# EAGLE schematic Accumulator TS Schematic (EAGLE 9.6.2)
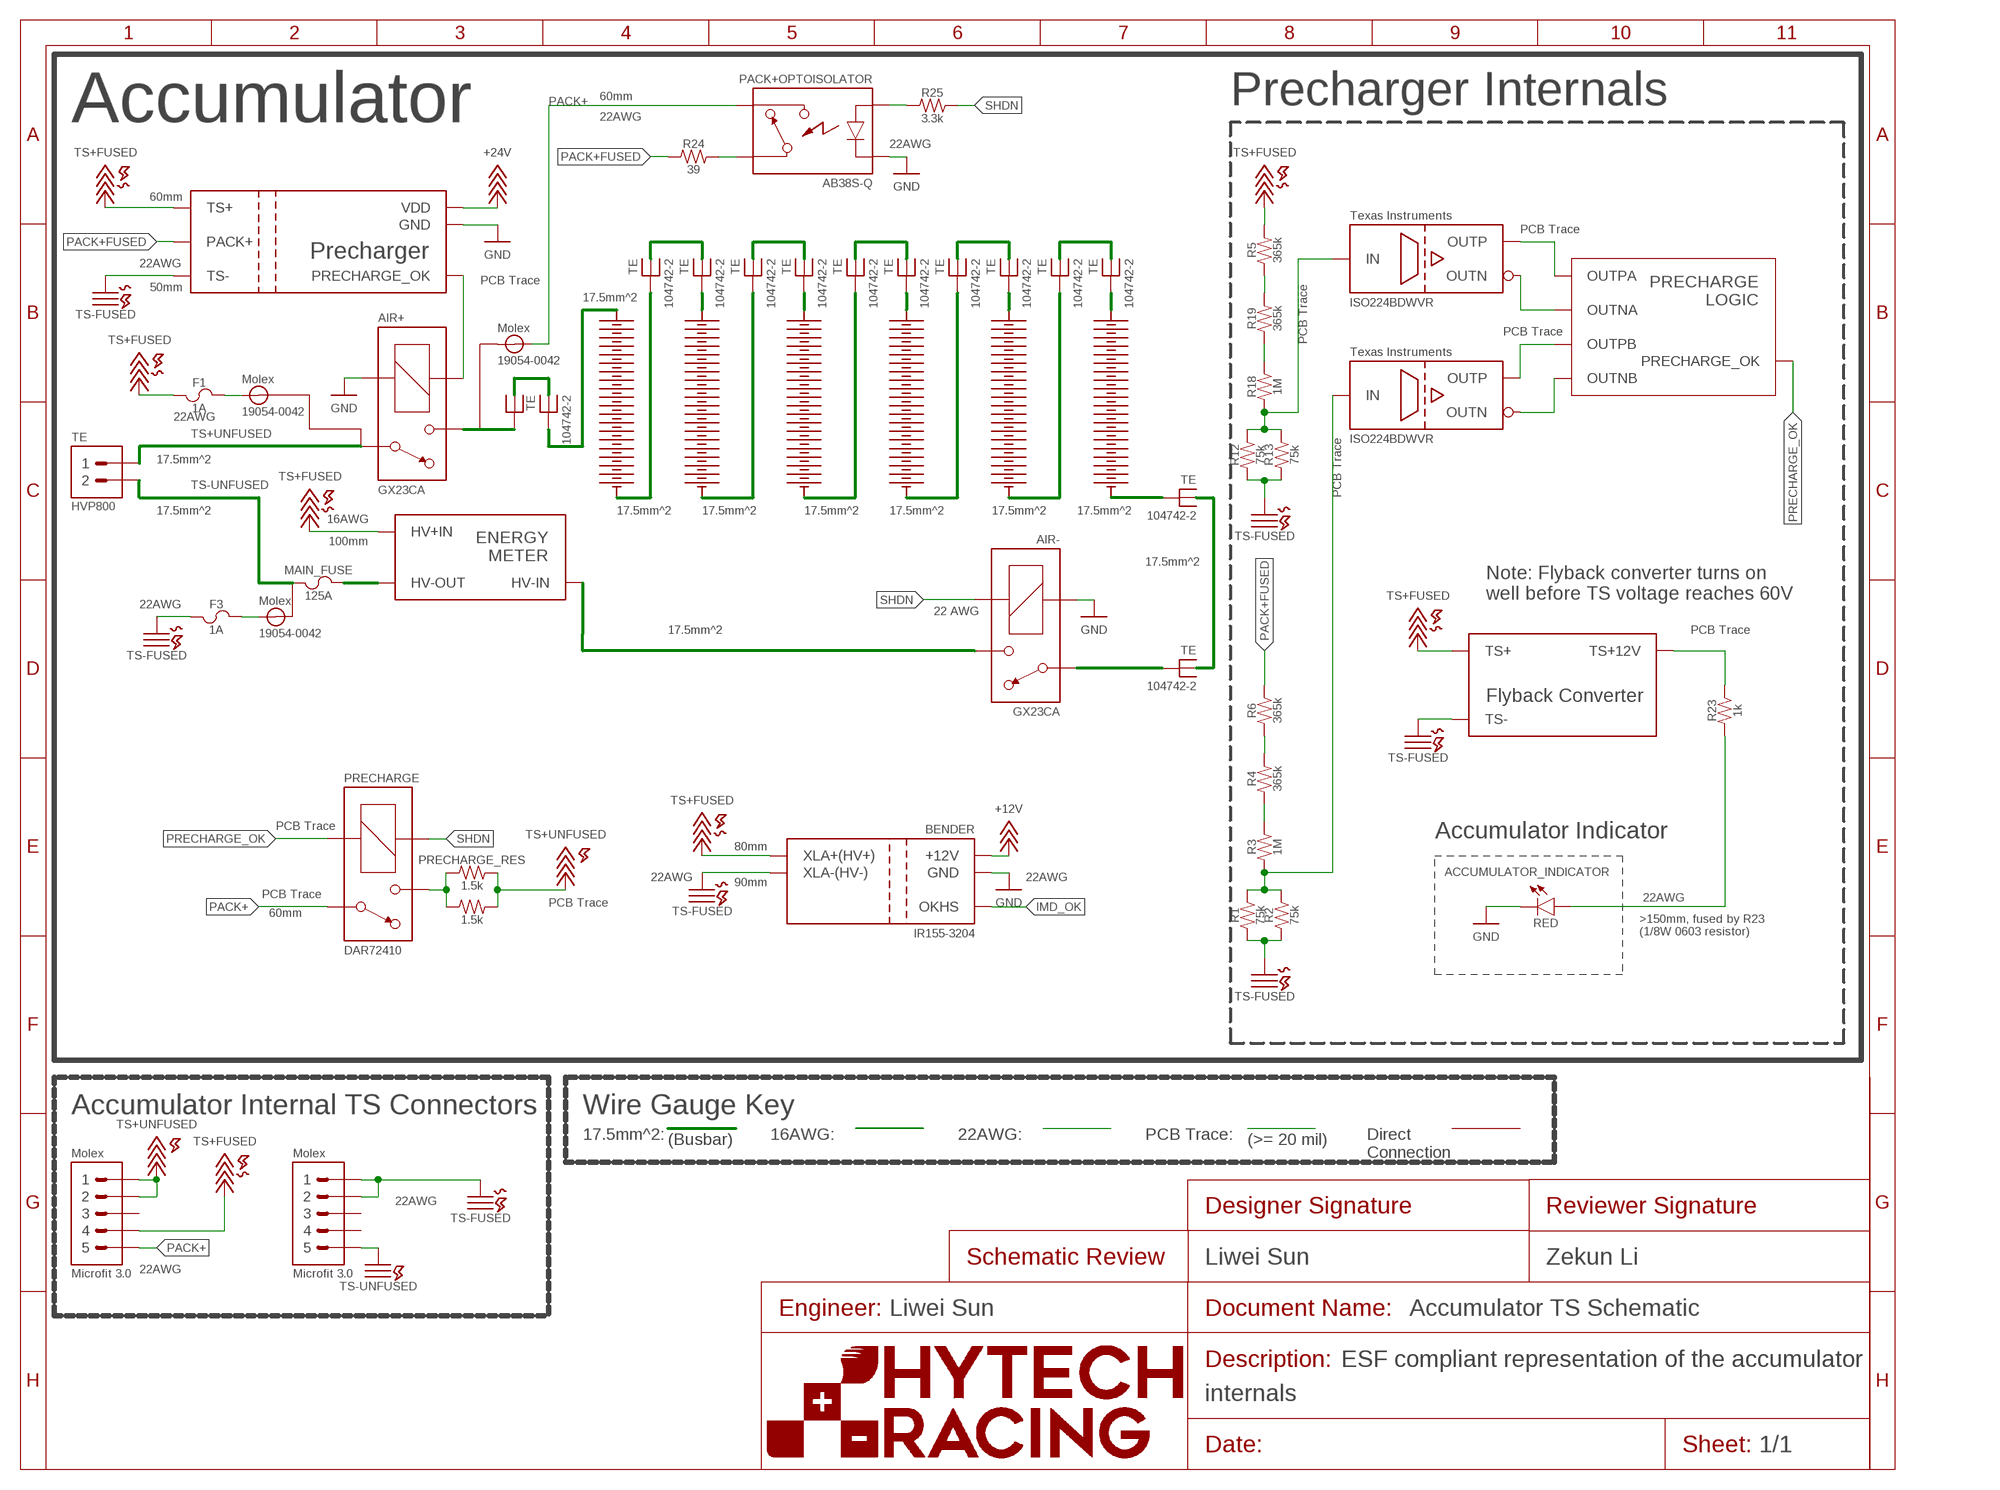
[diagram p0: schematic, sheet 1]
U$10 (FRAME_SCHEMATIC_ONLY): DESCRIPTION_1: ESF compliant representation of the accumulator; DESCRIPTION_2: internals; DESIGNER_SCHEMATIC: Liwei Sun; ENGINEER: Liwei Sun; REVIEWER_SCHEMATIC: Zekun Li

## Parts
A1  PRECHARGE_LOGIC  (no package)
ACCUMULATOR_INDICATOR  DIODE_LED  (no package)
AIR+  RELAY_SPST_NO_  (no package)
AIR-  RELAY_SPST_NO_  (no package)
F1  1A  FUSE  (no package)
F3  1A  FUSE  (no package)
J1  CONNECTOR-2_HVP800  (no package)
J6  CONNECTOR-5_MICROFIT  (no package)
J8  CONNECTOR-5_MICROFIT  (no package)
MAIN_FUSE  125A  FUSE  (no package)
PACK+OPTOISOLATOR  RELAY_SOLIDSTATE_NO_  (no package)
PRECHARGE  RELAY_SPST_NO_  (no package)
PRECHARGE_RES  1.5k  RESISTOR  (no package)
PRECHARGE_RES2  1.5k  RESISTOR  (no package)
R1  75k  RESISTOR  (no package)
R2  75k  RESISTOR  (no package)
R3  1M  RESISTOR  (no package)
R4  365k  RESISTOR  (no package)
R5  365k  RESISTOR  (no package)
R6  365k  RESISTOR  (no package)
R12  75k  RESISTOR  (no package)
R13  75k  RESISTOR  (no package)
R18  1M  RESISTOR  (no package)
R19  365k  RESISTOR  (no package)
R23  1k  RESISTOR  (no package)
R24  39  RESISTOR  (no package)
R25  3.3k  RESISTOR  (no package)
U1  ISO_224BDWVR  (no package)
U2  ISO_224BDWVR  (no package)
U$1  BENDER_IR155-3204  (no package)
U$2  SEGMENT  (no package)
U$3  SEGMENT  (no package)
U$4  SEGMENT  (no package)
U$5  SEGMENT  (no package)
U$6  SEGMENT  (no package)
U$7  MAINTENANCE_PLUG_104742-2  (no package)
U$8  MAINTENANCE_PLUG_104742-2  (no package)
U$9  MAINTENANCE_PLUG_104742-2  (no package)
U$11  PRECHARGER  (no package)
U$12  MAINTENANCE_PLUG_104742-2  (no package)
U$13  MAINTENANCE_PLUG_104742-2  (no package)
U$14  ENERGY_METER  (no package)
U$15  MAINTENANCE_PLUG_104742-2  (no package)
U$16  MAINTENANCE_PLUG_104742-2  (no package)
U$21  SEGMENT  (no package)
U$22  MAINTENANCE_PLUG_104742-2  (no package)
U$27  MAINTENANCE_PLUG_104742-2  (no package)
U$29  FLYBACK_CONVERTER  (no package)
U$31  MAINTENANCE_PLUG_104742-2  (no package)
U$32  MAINTENANCE_PLUG_104742-2  (no package)
U$33  MAINTENANCE_PLUG_104742-2  (no package)
U$34  MAINTENANCE_PLUG_104742-2  (no package)
U$35  MAINTENANCE_PLUG_104742-2  (no package)
U$36  RING_TERMINAL_19054-0042  (no package)
U$37  RING_TERMINAL_19054-0042  (no package)
U$38  RING_TERMINAL_19054-0042  (no package)

## Nets
+5V: U$11.VDD ; supply symbol labelled +24V
+12V: U$1.+12V
GND: ACCUMULATOR_INDICATOR.C AIR+.COIL+ AIR-.COIL+ PACK+OPTOISOLATOR.CONTROL- U$1.GND U$11.GND
IMD_OK: U$1.OKHS
N$1: U$3.- U$7.1
N$2: U$4.- U$15.1
N$3: U$5.- U$16.1
N$4: U$4.+ U$8.1
N$5: U$5.+ U$9.1
N$6: U$6.+ U$31.1
N$7: U$7.P$1 U$8.P$1
N$8: PRECHARGE.CONTACT2 PRECHARGE_RES2.1 PRECHARGE_RES.1
N$10: PACK+OPTOISOLATOR.CONTACT1 R24.2
N$11: PACK+OPTOISOLATOR.CONTROL+ R25.1
N$12: MAIN_FUSE.2 U$14.HV-OUT
N$13: R3.2 R4.1
N$14: R18.2 R19.1
N$15: U$6.- U$12.1
N$16: U$21.- U$34.1
N$17: AIR+.CONTACT2 U$32.1
N$18: R5.1 R19.2
N$19: AIR-.CONTACT1 U$35.1
N$20: R4.2 R6.1
N$21: U$9.P$1 U$15.P$1
N$22: U$2.+ U$13.1
N$23: U$16.P$1 U$31.P$1
N$24: U$12.P$1 U$13.P$1
N$25: U$2.- U$22.1
N$26: U$21.+ U$27.1
N$27: U$22.P$1 U$27.P$1
N$28: A1.OUTPB U1.OUTP
N$29: R1.2 R2.2 R3.1 U1.IN
N$30: U$32.P$1 U$33.P$1
N$31: A1.OUTNB U1.OUTN
N$32: A1.OUTPA U2.OUTP
N$33: U$34.P$1 U$35.P$1
N$34: A1.OUTNA U2.OUTN
N$35: R23.2 U$29.TS+12V
N$36: ACCUMULATOR_INDICATOR.A R23.1
N$45: AIR-.CONTACT2 U$14.HV-IN
N$48: R12.2 R13.2 R18.1 U2.IN
N$50: F3.2 U$36.P$1
N$51: F1.2 U$37.P$1
PACK+: J6.5 PACK+OPTOISOLATOR.CONTACT2 PRECHARGE.CONTACT1 U$3.+ U$33.1 U$38.P$2
PACK+FUSED: R6.2 R24.1 U$11.PACK+
PRECHARGE_OK: A1.PRECHARGE_OK AIR+.COIL- PRECHARGE.COIL+ U$11.PRECHARGE_OK
SHDN: AIR-.COIL- PRECHARGE.COIL- R25.2
TS+: F1.1 J6.4 R5.2 U$1.XLA+(HV+) U$11.TS+ ; supply symbol labelled TS+FUSED
TS+FUSED: U$14.HV+IN U$29.TS+
TS+UNFUSED: AIR+.CONTACT1 J1.1 J6.1 J6.2 PRECHARGE_RES2.2 PRECHARGE_RES.2
TS-FUSED: U$29.TS-
TS-UNFUSED: F3.1 J1.2 J8.1 J8.2 J8.5 MAIN_FUSE.1 R1.1 R2.1 R12.1 R13.1 U$1.XLA-(HV-) U$11.TS- ; supply symbol labelled TS-FUSED
Unconnected: J6.3 J8.3 J8.4 U$36.P$2 U$37.P$2 U$38.P$1

## Notes on the sheet
- Accumulator
- 60mm
- Precharger Internals
- 22AWG
- 22AWG
- 60mm
- PCB Trace
- 22AWG
- PCB Trace
- 50mm | 17.5mm^2
- PCB Trace
- PCB Trace
- 22AWG
- 17.5mm^2
- PCB Trace
- 17.5mm^2 | 16AWG | 17.5mm^2 | 17.5mm^2 | 17.5mm^2 | 17.5mm^2 | 17.5mm^2 | 17.5mm^2
- 100mm
- 17.5mm^2
- 22AWG
- Note: Flyback converter turns on 
  well before TS voltage reaches 60V
- 22 AWG
- 17.5mm^2 | PCB Trace
- PCB Trace
- Accumulator Indicator
- 80mm
- 22AWG | 22AWG
- 90mm
- PCB Trace
- 22AWG
- PCB Trace
- 60mm
- >150mm, fused by R23 
  (1/8W 0603 resistor)
- Accumulator Internal TS Connectors | Wire Gauge Key
- 17.5mm^2: | 16AWG: | 22AWG: | PCB Trace:
- Direct
  Connection
- (Busbar) | (>= 20 mil)
- 22AWG
- 22AWG

## Library data of the parts
A1 = HyTechSymbols:PRECHARGE_LOGIC: Block representation of the precharge logic.
ACCUMULATOR_INDICATOR = HyTechSymbols:DIODE_LED; COLOR: RED
AIR+ AIR- = HyTechSymbols:RELAY_SPST_NO_?*: Single pole single throw normally open relay 3350-1275-126 <https://drive.google.com/file/d/1L0NeZqCX2TFaVQbwFxpbbu9uMJSPuulv/view> GX23BA <https://drive.google.com/file/d/1Ccq0vir690jgHxUhztItQKfgtS51YNj_/view>; MPN: GX23CA
F1 F3 MAIN_FUSE = HyTechSymbolsTemp:FUSE
J1 = HyTechSymbols:CONNECTOR-2_*: Two pin connector EVH2-N2TK-TDA <https://drive.google.com/file/d/1gQfuywpa-Tm7bohh-tcSjjxbyqcnD_h9/view> HPK <https://drive.google.com/file/d/1jTQMZ26zoHotHQHZYMoMT2jUzRt664sO/view> HVP800 <https://drive.google.com/file/d/1j-HswfqYHj8usJ9E3bf8NWBzB-X0BKJ4/view>; MANUFACTURER: TE; MPN: HVP800
J6 J8 = HyTechSymbolsTemp:CONNECTOR-5_*: Five pin connector Micro-Fit 3.0 <https://drive.google.com/file/d/1Be8WGxzm3IeOWSN4qfSP8J4bwHUWCwaO/view>; MANUFACTURER: Molex; MPN: Microfit 3.0
PACK+OPTOISOLATOR = HyTechSymbols:RELAY_SOLIDSTATE_NO_*: Solid-state single pole single throw normally open relay CMX60D20 <https://drive.google.com/file/d/11HaAODTxMI5zJ0hT5nquYCFtw3_aAMfR/view>; MPN: AB38S-Q
PRECHARGE = HyTechSymbols:RELAY_SPST_NO_?*: Single pole single throw normally open relay 3350-1275-126 <https://drive.google.com/file/d/1L0NeZqCX2TFaVQbwFxpbbu9uMJSPuulv/view> GX23BA <https://drive.google.com/file/d/1Ccq0vir690jgHxUhztItQKfgtS51YNj_/view>; MPN: DAR72410
PRECHARGE_RES PRECHARGE_RES2 R1-R6 R12 R13 R18 R19 R23-R25 = HyTechSymbolsTemp:RESISTOR
U1 U2 = HyTechSymbolsTemp:ISO_224*: ISO224*: Isolated precision amplifier Datasheet <https://www.ti.com/lit/ds/symlink/iso224.pdf>; MANUFACTURER: Texas Instruments; MPN: ISO224BDWVR
U$1 = HyTechSymbols:BENDER_IR155-3204: Bender IR155-3204 Insulation Monitoring Device Datasheet <http://www.bender-es.com/fileadmin/products/doc/IR155-32xx-V004_D00115_D_XXEN.pdf>
U$2-U$6 U$21 = HyTechSymbols:SEGMENT
U$7-U$9 U$12 U$13 U$15 U$16 U$22 U$27 U$31-U$35 = HyTechSymbolsTemp:MAINTENANCE_PLUG_*; MANUFACTURER: TE; MPN: 104742-2
U$11 = HyTechSymbolsTemp:PRECHARGER: Block representation of the HT06 precharger.
U$14 = HyTechSymbolsTemp:ENERGY_METER: Block representation of the FSAE energy meter.
U$29 = HyTechSymbols:FLYBACK_CONVERTER
U$36-U$38 = HyTechSymbolsTemp:RING_TERMINAL_*: Ring terminal 19054-0042 <https://drive.google.com/drive/folders/1JhKTbRtwaszOvYIb3y-YkBSe0CyrUopM>; MANUFACTURER: Molex; MPN: 19054-0042